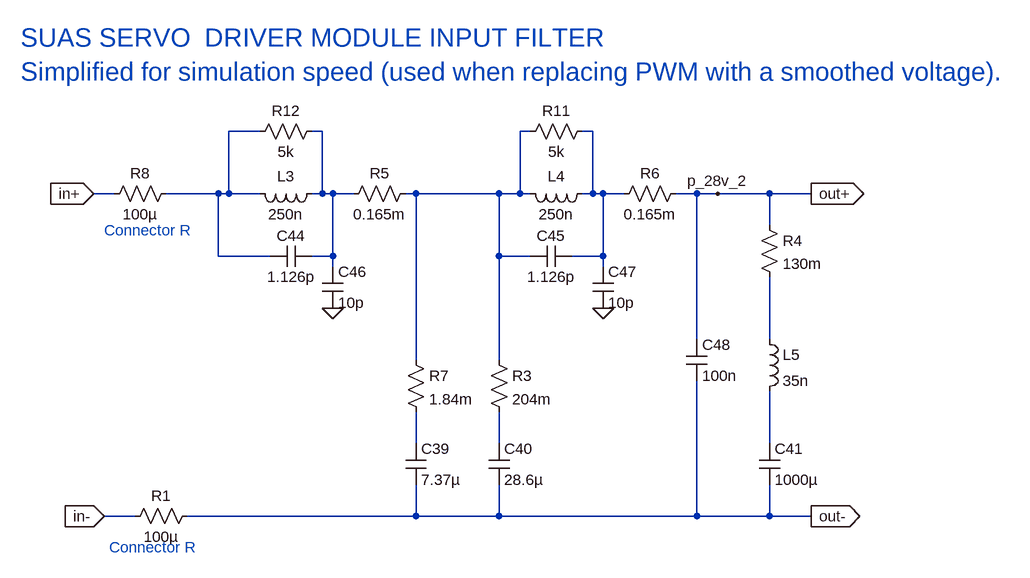
[diagram p0: schematic USA13030_X1_NG_cont_in_fltr.asc]
USA13030_X1_NG_cont_in_fltr.asc, the LTspice schematic file:
Version 4
SHEET 1 2412 680
WIRE -496 -1104 -544 -1104
WIRE -400 -1104 -416 -1104
WIRE -80 -1104 -96 -1104
WIRE 16 -1104 0 -1104
WIRE -720 -1008 -752 -1008
WIRE -560 -1008 -640 -1008
WIRE -544 -1008 -544 -1104
WIRE -544 -1008 -560 -1008
WIRE -496 -1008 -544 -1008
WIRE -400 -1008 -400 -1104
WIRE -400 -1008 -416 -1008
WIRE -384 -1008 -400 -1008
WIRE -352 -1008 -384 -1008
WIRE -256 -1008 -272 -1008
WIRE -128 -1008 -256 -1008
WIRE -96 -1008 -96 -1104
WIRE -96 -1008 -128 -1008
WIRE -80 -1008 -96 -1008
WIRE 16 -1008 16 -1104
WIRE 16 -1008 0 -1008
WIRE 32 -1008 16 -1008
WIRE 64 -1008 32 -1008
WIRE 176 -1008 144 -1008
WIRE 208 -1008 176 -1008
WIRE 288 -1008 208 -1008
WIRE 352 -1008 288 -1008
WIRE 288 -960 288 -1008
WIRE -560 -912 -560 -1008
WIRE -480 -912 -560 -912
WIRE -384 -912 -384 -1008
WIRE -384 -912 -416 -912
WIRE -128 -912 -128 -1008
WIRE -80 -912 -128 -912
WIRE 32 -912 32 -1008
WIRE 32 -912 -16 -912
WIRE -384 -896 -384 -912
WIRE 32 -896 32 -912
WIRE 176 -784 176 -1008
WIRE 288 -784 288 -880
WIRE -256 -752 -256 -1008
WIRE -128 -752 -128 -912
WIRE -256 -624 -256 -672
WIRE -128 -624 -128 -672
WIRE 288 -624 288 -704
WIRE -688 -512 -736 -512
WIRE -256 -512 -256 -560
WIRE -256 -512 -608 -512
WIRE -128 -512 -128 -560
WIRE -128 -512 -256 -512
WIRE 176 -512 176 -720
WIRE 176 -512 -128 -512
WIRE 288 -512 288 -560
WIRE 288 -512 176 -512
WIRE 352 -512 288 -512
FLAG -752 -1008 in+
IOPIN -752 -1008 In
FLAG 352 -1008 out+
IOPIN 352 -1008 Out
FLAG -736 -512 in-
IOPIN -736 -512 In
FLAG 352 -512 out-
IOPIN 352 -512 Out
FLAG -384 -832 0
FLAG 32 -832 0
FLAG 208 -1008 p_28v_2
SYMBOL ind -400 -1024 R90
WINDOW 0 5 56 VBottom 2
WINDOW 3 32 56 VTop 2
WINDOW 39 60 56 VTop 2
SYMATTR InstName L3
SYMATTR Value 250n
SYMBOL ind 16 -1024 R90
WINDOW 0 5 56 VBottom 2
WINDOW 3 32 56 VTop 2
WINDOW 39 60 56 VTop 2
SYMATTR InstName L4
SYMATTR Value 250n
SYMBOL cap -272 -624 R0
WINDOW 39 24 36 Left 2
SYMATTR InstName C39
SYMATTR Value 7.37µ
SYMBOL cap -144 -624 R0
WINDOW 39 24 36 Left 2
SYMATTR InstName C40
SYMATTR Value 28.6µ
SYMBOL cap 272 -624 R0
WINDOW 39 24 36 Left 2
SYMATTR InstName C41
SYMATTR Value 1000µ
SYMBOL res -144 -768 R0
SYMATTR InstName R3
SYMATTR Value 204m
SYMBOL res 272 -976 R0
SYMATTR InstName R4
SYMATTR Value 130m
SYMBOL ind 272 -800 R0
SYMATTR InstName L5
SYMATTR Value 35n
SYMBOL res -256 -1024 R90
WINDOW 0 0 56 VBottom 2
WINDOW 3 32 56 VTop 2
SYMATTR InstName R5
SYMATTR Value 0.165m
SYMBOL res 160 -1024 R90
WINDOW 0 0 56 VBottom 2
WINDOW 3 32 56 VTop 2
SYMATTR InstName R6
SYMATTR Value 0.165m
SYMBOL res -272 -768 R0
SYMATTR InstName R7
SYMATTR Value 1.84m
SYMBOL res 16 -1120 R90
WINDOW 0 0 56 VBottom 2
WINDOW 3 32 56 VTop 2
SYMATTR InstName R11
SYMATTR Value 5k
SYMBOL res -400 -1120 R90
WINDOW 0 0 56 VBottom 2
WINDOW 3 32 56 VTop 2
SYMATTR InstName R12
SYMATTR Value 5k
SYMBOL cap -416 -928 R90
WINDOW 0 0 32 VBottom 2
WINDOW 3 32 32 VTop 2
SYMATTR InstName C44
SYMATTR Value 1.126p
SYMBOL cap -16 -928 R90
WINDOW 0 0 32 VBottom 2
WINDOW 3 32 32 VTop 2
SYMATTR InstName C45
SYMATTR Value 1.126p
SYMBOL cap -400 -896 R0
SYMATTR InstName C46
SYMATTR Value 10p
SYMBOL cap 16 -896 R0
SYMATTR InstName C47
SYMATTR Value 10p
SYMBOL cap 160 -784 R0
SYMATTR InstName C48
SYMATTR Value 100n
SYMBOL res -624 -1024 R90
WINDOW 0 0 56 VBottom 2
WINDOW 3 32 56 VTop 2
SYMATTR InstName R8
SYMATTR Value 100µ
SYMBOL res -592 -528 R90
WINDOW 0 0 56 VBottom 2
WINDOW 3 32 56 VTop 2
SYMATTR InstName R1
SYMATTR Value 100µ
TEXT -864 -1248 Left 4 ;SUAS SERVO  DRIVER MODULE INPUT FILTER\nSimplified for simulation speed (used when replacing PWM with a smoothed voltage).
TEXT -736 -952 Left 2 ;Connector R
TEXT -728 -464 Left 2 ;Connector R

The netlist it stands for:
* USA13030_X1_NG_cont_in_fltr.asc
L3 N002 N001 250n
L4 N004 N003 250n
C39 N006 out- 7.37µ
C40 N007 out- 28.6µ
C41 N008 out- 1000µ
R3 N003 N007 204m
R4 p_28v_2 N005 130m
L5 N005 N008 35n
R5 N003 N002 0.165m
R6 p_28v_2 N004 0.165m
R7 N003 N006 1.84m
R11 N004 N003 5k
R12 N002 N001 5k
C44 N002 N001 1.126p
C45 N004 N003 1.126p
C46 N002 0 10p
C47 N004 0 10p
C48 p_28v_2 out- 100n
R8 N001 in+ 100µ
R1 out- in- 100µ
* SUAS SERVO  DRIVER MODULE INPUT FILTER
* Simplified for simulation speed (used when replacing PWM with a smoothed voltage).
* Connector R
* Connector R
.backanno
.end